# Altium schematic sheet [04] - REVISION HISTORY-V1.1.SchDoc
size A3; DocumentNumber: 4; SheetNumber: 4; SheetTotal: 4
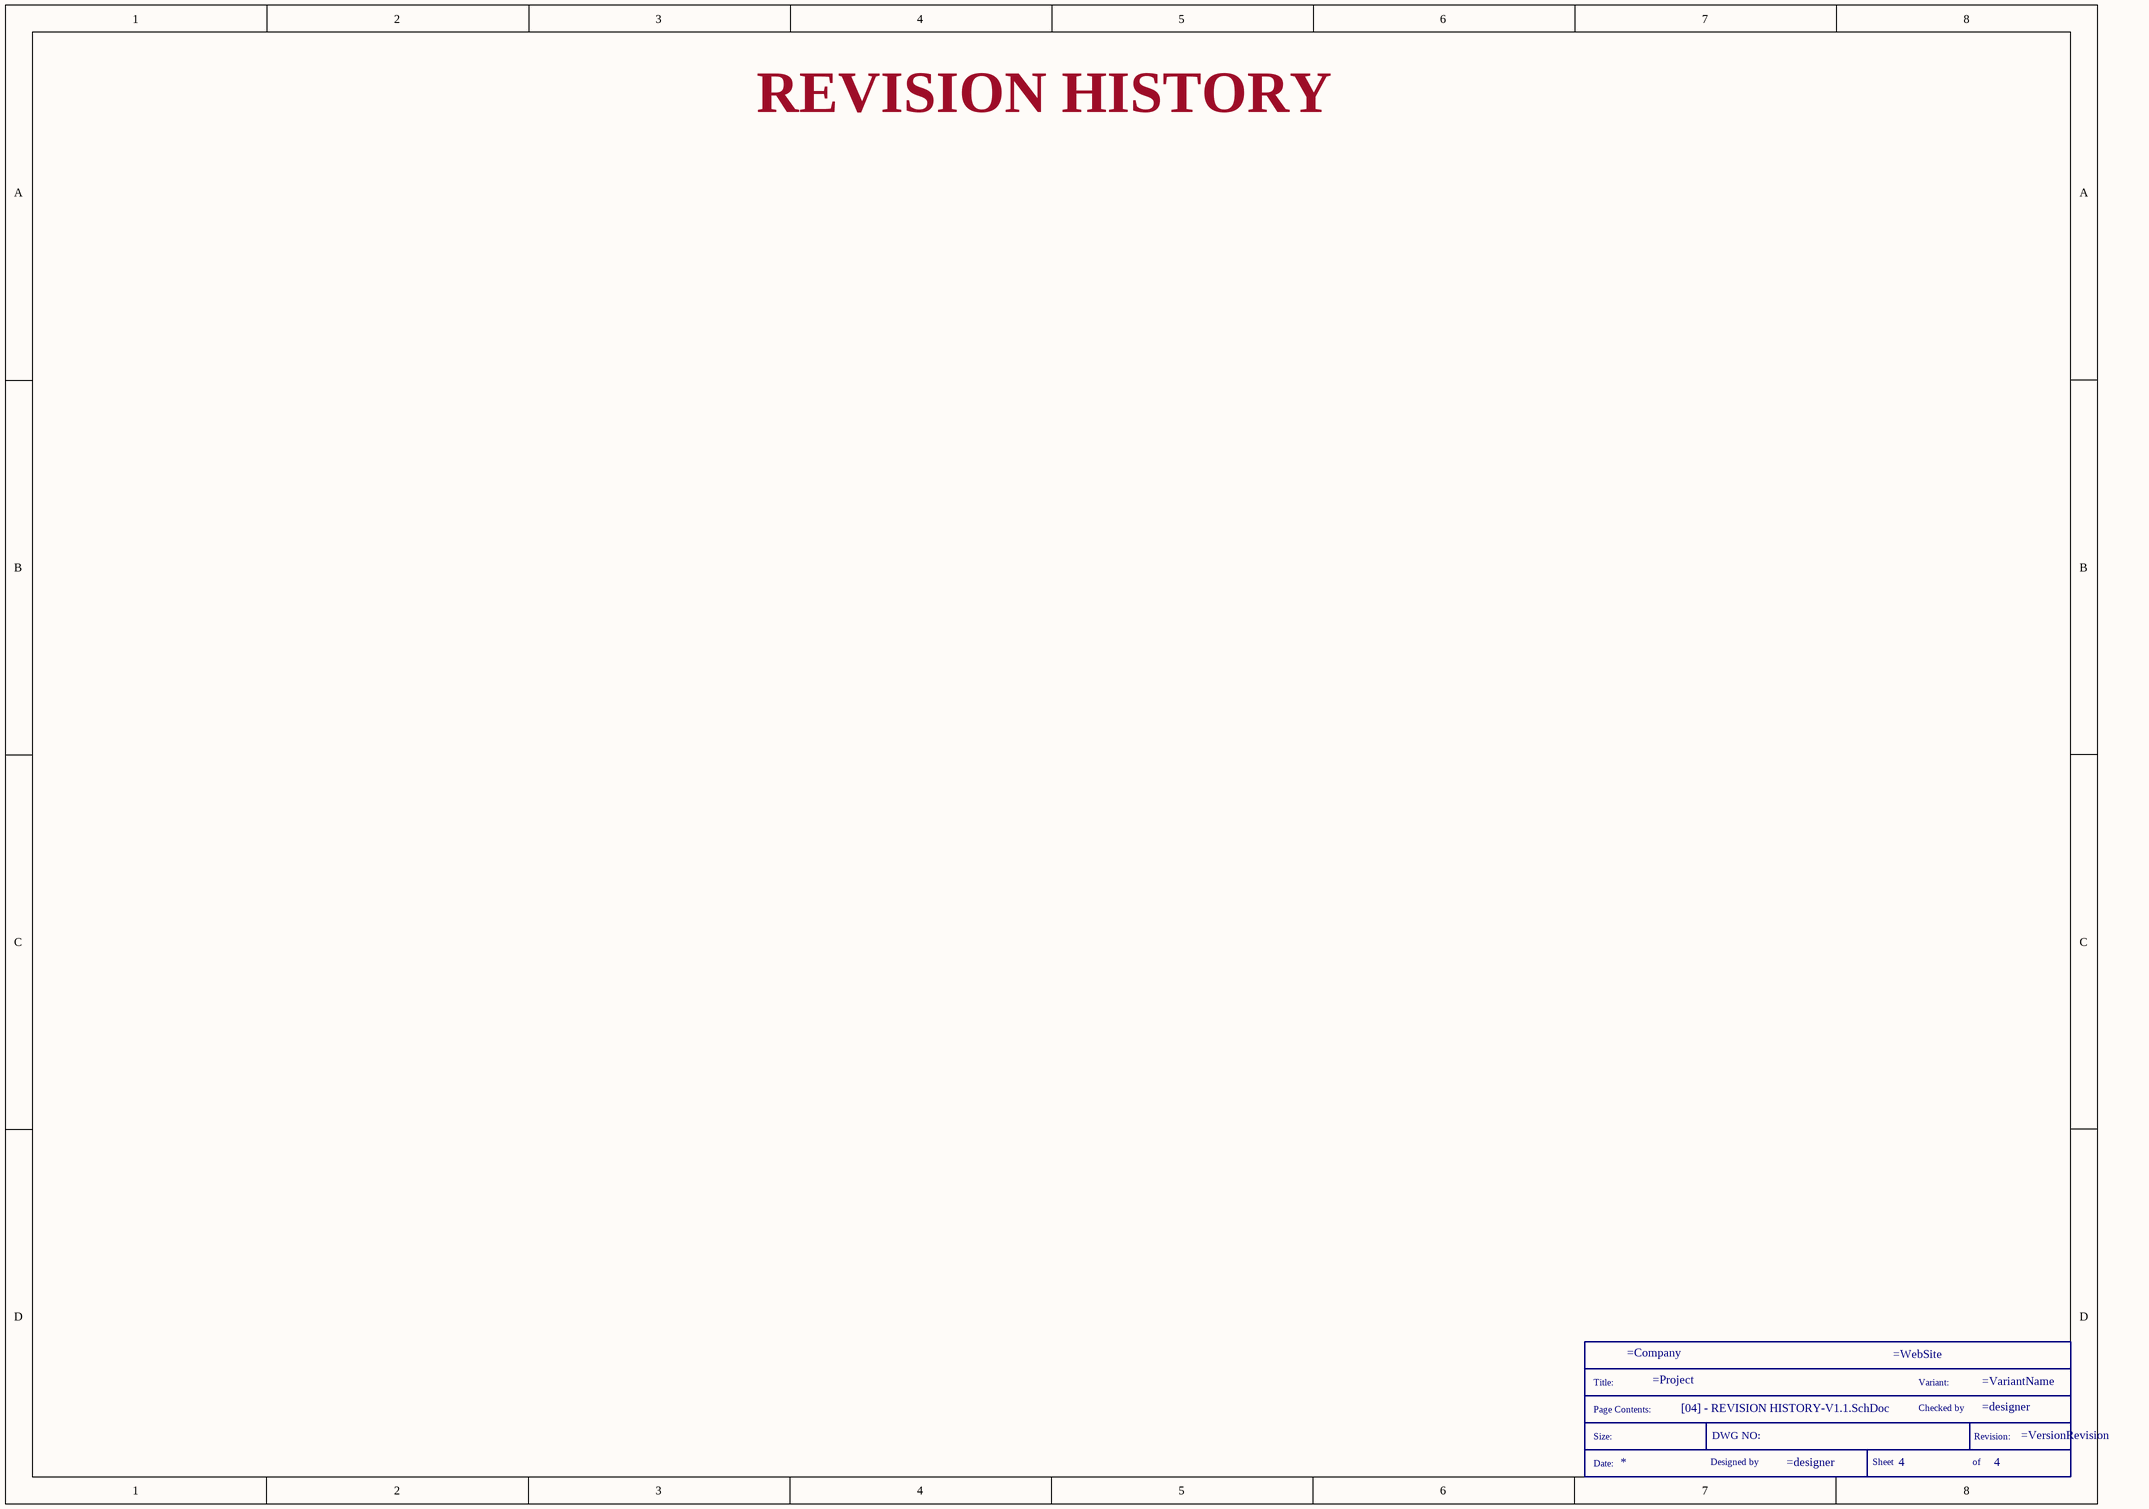
[diagram p0: [04] - REVISION HISTORY-V1.1.SchDoc]

## Parts
*  SCH_TITLE  (value not drawn)  (graphical)

## Notes on the sheet
- REVISION HISTORY
- (in symbol SCH_TITLE) Title:; Variant:; Page Contents:; Checked by; Size:; DWG NO:; Revision:; Date:; Designed by; Sheet; of